# EAGLE schematic urbanNoiseMonitor (EAGLE 8.4.3)
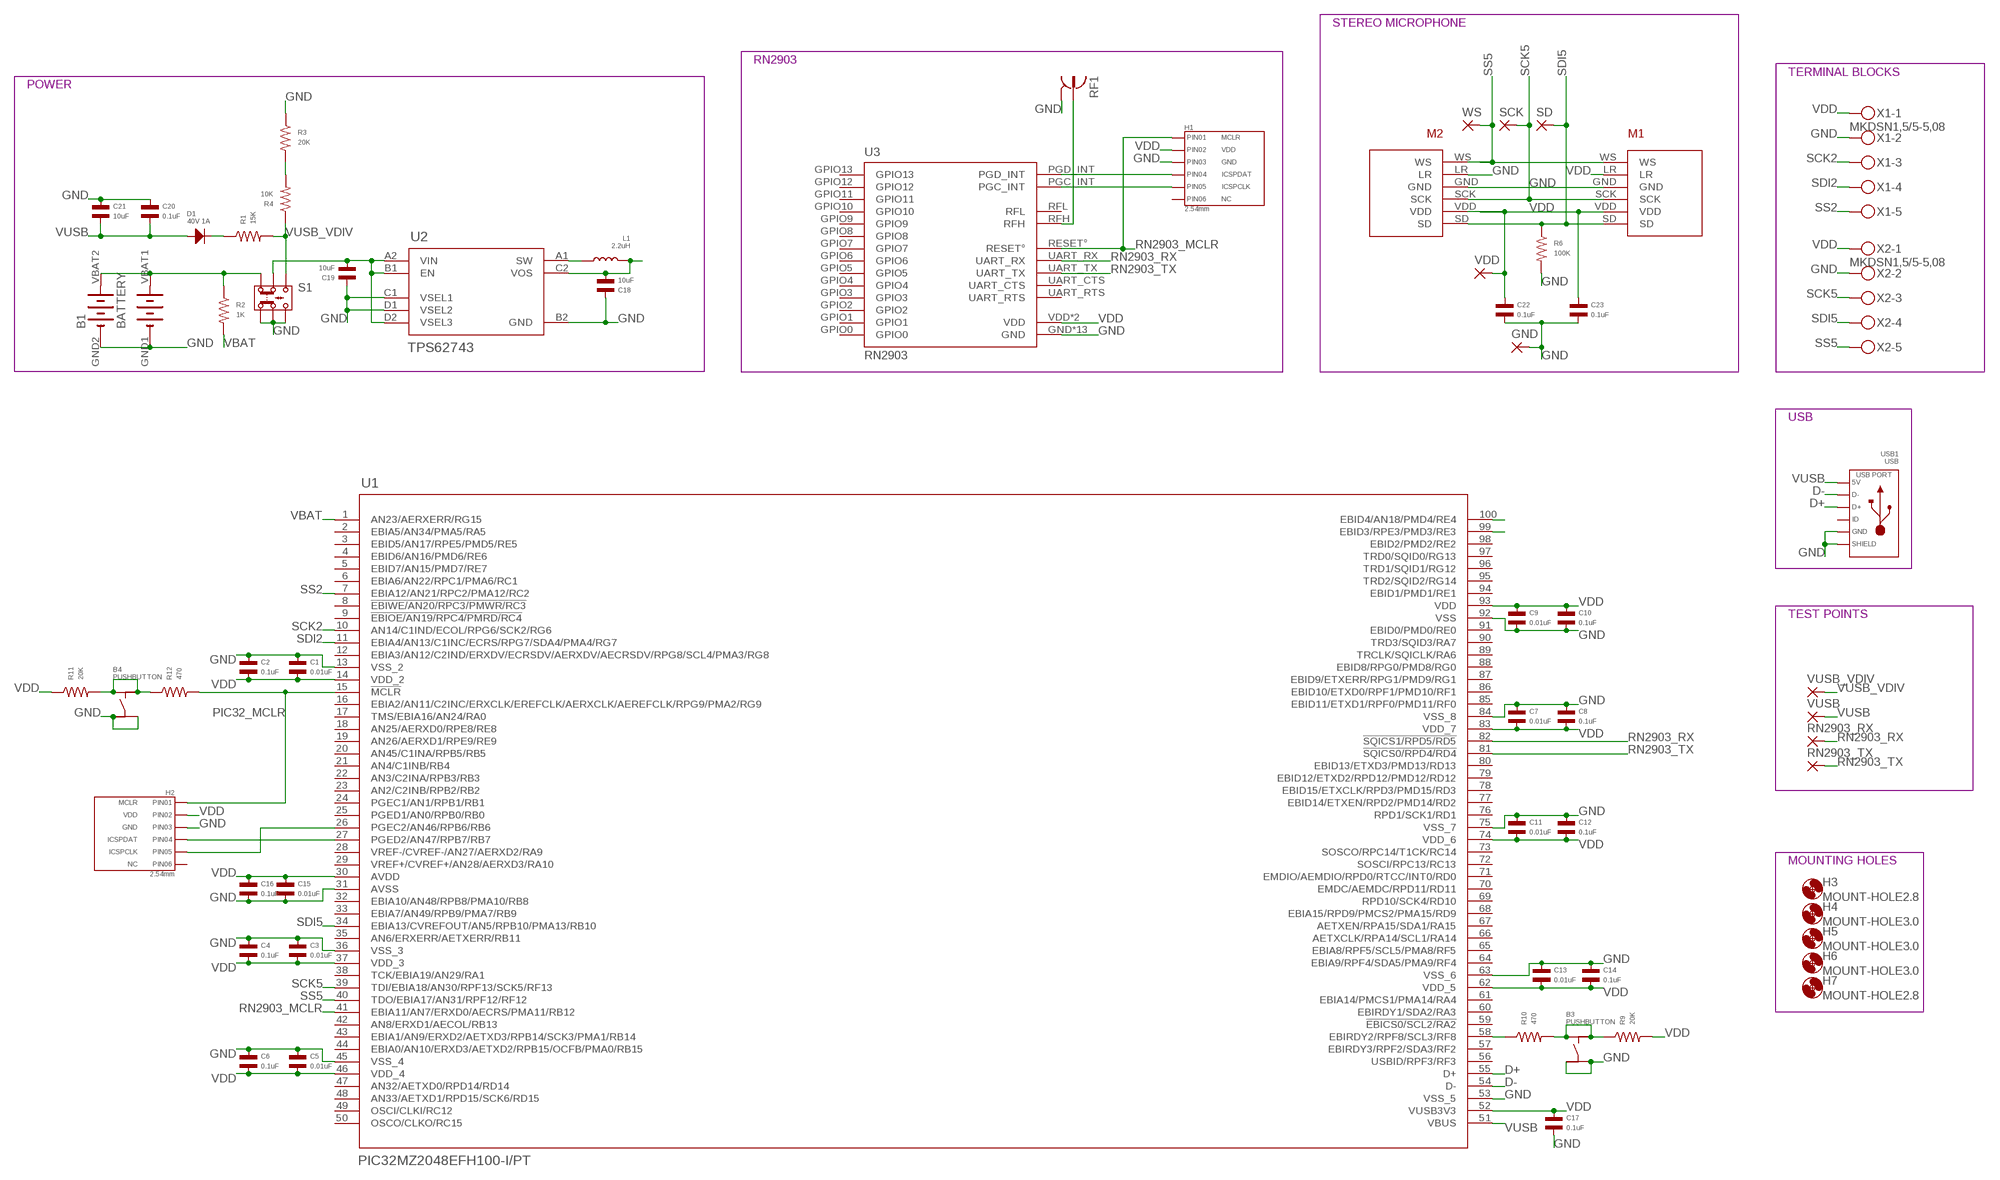
[diagram p0: schematic, sheet 1]

## Parts
B1  BATTERY  [36-2227-ND]
B3  PUSHBUTTON  [TACT6MM]
B4  PUSHBUTTON  [TACT6MM]
C1  0.01uF  CAPACITOR_NP  [C0402]
C2  0.1uF  CAPACITOR_NP  [C0402]
C3  0.01uF  CAPACITOR_NP  [C0402]
C4  0.1uF  CAPACITOR_NP  [C0402]
C5  0.01uF  CAPACITOR_NP  [C0402]
C6  0.1uF  CAPACITOR_NP  [C0402]
C7  0.01uF  CAPACITOR_NP  [C0402]
C8  0.1uF  CAPACITOR_NP  [C0402]
C9  0.01uF  CAPACITOR_NP  [C0402]
C10  0.1uF  CAPACITOR_NP  [C0402]
C11  0.01uF  CAPACITOR_NP  [C0402]
C12  0.1uF  CAPACITOR_NP  [C0402]
C13  0.01uF  CAPACITOR_NP  [C0402]
C14  0.1uF  CAPACITOR_NP  [C0402]
C15  0.01uF  CAPACITOR_NP  [C0402]
C16  0.1uF  CAPACITOR_NP  [C0402]
C17  0.1uF  CAPACITOR_NP  [C0402]
C18  10uF  CAPACITOR_NPC1206  [C1206]
C19  10uF  CAPACITOR_NPC1206  [C1206]
C20  0.1uF  CAPACITOR_NP  [C0402]
C21  10uF  CAPACITOR_NPC1206  [C1206]
C22  0.1uF  CAPACITOR_NP  [C0402]
C23  0.1uF  CAPACITOR_NP  [C0402]
D1  40V 1A  SCHOTTKY_DIODE  [SMA]
GND  2,54/1,0  [2,54/1,0]
H1  2.54mm  HEADER_PINS  [PTH_2.54MM_01X06]
H2  2.54mm  HEADER_PINS  [PTH_2.54MM_01X06]
H3  MOUNT-HOLE2.8  [2,8]
H4  MOUNT-HOLE3.0  [3,0]
H5  MOUNT-HOLE3.0  [3,0]
H6  MOUNT-HOLE3.0  [3,0]
H7  MOUNT-HOLE2.8  [2,8]
L1  2.2uH  DFE201610C  [L2016]
M1  MICROPHONE  [ICS-43434]
M2  MICROPHONE  [ICS-43434]
R1  15K  RESISTOR  [R0402]
R2  1K  RESISTOR  [R0402]
R3  20K  RESISTORR0805  [R0805]
R4  10K  RESISTOR  [R0402]
R6  100K  RESISTOR  [R0402]
R9  20K  RESISTORR0805  [R0805]
R10  470  RESISTOR  [R0402]
R11  20K  RESISTORR0805  [R0805]
R12  470  RESISTOR  [R0402]
RF1  SMA_JACK  [J502-ND-142-0711-821/826]
RN2903_RX  2,54/1,0  [2,54/1,0]
RN2903_TX  2,54/1,0  [2,54/1,0]
S1  SLIDING_SWITCH  [DPDT]
SCK  2,54/1,0  [2,54/1,0]
SD  2,54/1,0  [2,54/1,0]
U1  PIC32MZ2048EFH100-I/PT  [TQFP100_12X12MC]
U2  TPS62743  [YFP0008AGAC]
U3  RN2903  [RN2903]
USB1  USB  [MICROUSB-RIGHT]
VDD  2,54/1,0  [2,54/1,0]
VUSB  2,54/1,0  [2,54/1,0]
VUSB_VDIV  2,54/1,0  [2,54/1,0]
WS  2,54/1,0  [2,54/1,0]
X1  MKDSN1,5/5-5,08  [MKDSN1,5/5-5,08]
X2  MKDSN1,5/5-5,08  [MKDSN1,5/5-5,08]

## Nets
D+: U1.55(D+) USB1.3(D+)
D-: U1.54(D-) USB1.2(D-)
GND: B1.GND1 B1.GND2 B3.P$3 B3.P$4 B4.P$3 B4.P$4 C1.P$1 C2.P$1 C3.P$1 C4.P$1 C5.P$1 C6.P$1 C7.P$1 C8.P$1 C9.P$2 C10.P$2 C11.P$1 C12.P$1 C13.P$1 C14.P$1 C15.P$2 C16.P$2 C17.P$2 C18.P$1 C19.P$1 C20.P$1 C21.P$1 C22.P$2 C23.P$2 GND.1(P) H1.P$3(PIN3) H2.P$3(PIN3) M1.GND M2.GND M2.LR R3.P$1 R6.P$2 RF1.G@1 RF1.G@2 RF1.G@3 RF1.G@4 S1.1 S1.2 S1.3 U1.13(VSS_2) U1.31(AVSS) U1.36(VSS_3) U1.45(VSS_4) U1.53(VSS_5) U1.63(VSS_6) U1.75(VSS_7) U1.84(VSS_8) U1.92(VSS) U2.B2(GND) U2.C1(VSEL1) U2.D1(VSEL2) U3.GND U3.GND1(GND) U3.GND2(GND) U3.GND3(GND) U3.GND4(GND) U3.GND5(GND) U3.GND6(GND) U3.GND7(GND) U3.GND8(GND) U3.GND9(GND) U3.GND10(GND) U3.GND11(GND) U3.GND12(GND) USB1.5(GND) USB1.S1(SLD) USB1.S2(SLD) USB1.S3(SLD) USB1.S4(SLD) USB1.S5(SLD) USB1.S6(SLD) X1.2 X2.2
N$1: L1.P$2 U2.A1(SW)
N$2: C19.P$2 S1.5 U2.A2(VIN) U2.B1(EN) U2.D2(VSEL3)
N$3: B1.VBAT1 B1.VBAT2 R2.P$1 S1.4
N$4: D1.CATHODE R1.P$1
N$6: R3.P$2 R4.P$2
N$7: H1.P$4(PIN4) U3.PGD_INT
N$8: U1.100(EBID4/AN18/PMD4/RE4)
N$9: H1.P$5(PIN5) U3.PGC_INT
N$10: RF1.1 U3.RFH
N$11: U1.99(EBID3/RPE3/PMD3/RE3)
N$14: B3.P$1 B3.P$2 R9.P$1 R10.P$2
N$15: R10.P$1 U1.58(EBIRDY2/RPF8/SCL3/RF8)
N$17: H2.P$4(PIN4) U1.27(PGED2/AN47/RPB7/RB7)
N$18: H2.P$5(PIN5) U1.26(PGEC2/AN46/RPB6/RB6)
N$19: B4.P$1 B4.P$2 R11.P$2 R12.P$1
PIC32_MCLR: H2.P$1(PIN1) R12.P$2 U1.15(!MCLR)
RN2903_MCLR: H1.P$1(PIN1) U1.41(EBIA11/AN7/ERXD0/AECRS/PMA11/RB12) U3.RESET°
RN2903_RX: RN2903_RX.1(P) U1.82(!SQICS1/RPD5/RD5) U3.UART_RX
RN2903_TX: RN2903_TX.1(P) U1.81(!SQICS0/RPD4/RD4) U3.UART_TX
SCK2: U1.10(AN14/C1IND/ECOL/RPG6/SCK2/RG6) X1.3
SCK5: M1.SCK M2.SCK SCK.1(P) U1.39(TDI/EBIA18/AN30/RPF13/SCK5/RF13) X2.3
SDI2: U1.11(EBIA4/AN13/C1INC/ECRS/RPG7/SDA4/PMA4/RG7) X1.4
SDI5: M1.SD M2.SD R6.P$1 SD.1(P) U1.34(EBIA13/CVREFOUT/AN5/RPB10/PMA13/RB10) X2.4
SS2: U1.7(EBIA12/AN21/RPC2/PMA12/RC2) X1.5
SS5: M1.WS M2.WS U1.40(TDO/EBIA17/AN31/RPF12/RF12) WS.1(P) X2.5
VBAT: R2.P$2 U1.1(AN23/AERXERR/RG15)
VDD: C1.P$2 C2.P$2 C3.P$2 C4.P$2 C5.P$2 C6.P$2 C7.P$2 C8.P$2 C9.P$1 C10.P$1 C11.P$2 C12.P$2 C13.P$2 C14.P$2 C15.P$1 C16.P$1 C17.P$1 C18.P$2 C22.P$1 C23.P$1 H1.P$2(PIN2) H2.P$2(PIN2) L1.P$1 M1.LR M1.VDD M2.VDD R9.P$2 R11.P$1 U1.14(VDD_2) U1.30(AVDD) U1.37(VDD_3) U1.46(VDD_4) U1.52(VUSB3V3) U1.62(VDD_5) U1.74(VDD_6) U1.83(VDD_7) U1.93(VDD) U2.C2(VOS) U3.VDD U3.VDD2(VDD) VDD.1(P) X1.1 X2.1
VUSB: C20.P$2 C21.P$2 D1.ANODE U1.51(VBUS) USB1.1(5V) VUSB.1(P)
VUSB_VDIV: R1.P$2 R4.P$1 S1.6 VUSB_VDIV.1(P)
Unconnected: H1.P$6(PIN6) H2.P$6(PIN6) U1.2(EBIA5/AN34/PMA5/RA5) U1.3(EBID5/AN17/RPE5/PMD5/RE5) U1.4(EBID6/AN16/PMD6/RE6) U1.5(EBID7/AN15/PMD7/RE7) U1.6(EBIA6/AN22/RPC1/PMA6/RC1) U1.8(!EBIWE/AN20/RPC3/PMWR/RC3) U1.9(!EBIOE/AN19/RPC4/PMRD/RC4) U1.12(EBIA3/AN12/C2IND/ERXDV/ECRSDV/AERXDV/AECRSDV/RPG8/SCL4/PMA3/RG8) U1.16(EBIA2/AN11/C2INC/ERXCLK/EREFCLK/AERXCLK/AEREFCLK/RPG9/PMA2/RG9) U1.17(TMS/EBIA16/AN24/RA0) U1.18(AN25/AERXD0/RPE8/RE8) U1.19(AN26/AERXD1/RPE9/RE9) U1.20(AN45/C1INA/RPB5/RB5) U1.21(AN4/C1INB/RB4) U1.22(AN3/C2INA/RPB3/RB3) U1.23(AN2/C2INB/RPB2/RB2) U1.24(PGEC1/AN1/RPB1/RB1) U1.25(PGED1/AN0/RPB0/RB0) U1.28(VREF-/CVREF-/AN27/AERXD2/RA9) U1.29(VREF+/CVREF+/AN28/AERXD3/RA10) U1.32(EBIA10/AN48/RPB8/PMA10/RB8) U1.33(EBIA7/AN49/RPB9/PMA7/RB9) U1.35(AN6/ERXERR/AETXERR/RB11) U1.38(TCK/EBIA19/AN29/RA1) U1.42(AN8/ERXD1/AECOL/RB13) U1.43(EBIA1/AN9/ERXD2/AETXD3/RPB14/SCK3/PMA1/RB14) U1.44(EBIA0/AN10/ERXD3/AETXD2/RPB15/OCFB/PMA0/RB15) U1.47(AN32/AETXD0/RPD14/RD14) U1.48(AN33/AETXD1/RPD15/SCK6/RD15) U1.49(OSCI/CLKI/RC12) U1.50(OSCO/CLKO/RC15) U1.56(USBID/RPF3/RF3) U1.57(EBIRDY3/RPF2/SDA3/RF2) U1.59(!EBICS0/SCL2/RA2) U1.60(EBIRDY1/SDA2/RA3) U1.61(EBIA14/PMCS1/PMA14/RA4) U1.64(EBIA9/RPF4/SDA5/PMA9/RF4) U1.65(EBIA8/RPF5/SCL5/PMA8/RF5) U1.66(AETXCLK/RPA14/SCL1/RA14) U1.67(AETXEN/RPA15/SDA1/RA15) U1.68(EBIA15/RPD9/PMCS2/PMA15/RD9) U1.69(RPD10/SCK4/RD10) U1.70(EMDC/AEMDC/RPD11/RD11) U1.71(EMDIO/AEMDIO/RPD0/RTCC/INT0/RD0) U1.72(SOSCI/RPC13/RC13) U1.73(SOSCO/RPC14/T1CK/RC14) U1.76(RPD1/SCK1/RD1) U1.77(EBID14/ETXEN/RPD2/PMD14/RD2) U1.78(EBID15/ETXCLK/RPD3/PMD15/RD3) U1.79(EBID12/ETXD2/RPD12/PMD12/RD12) U1.80(EBID13/ETXD3/PMD13/RD13) U1.85(EBID11/ETXD1/RPF0/PMD11/RF0) U1.86(EBID10/ETXD0/RPF1/PMD10/RF1) U1.87(EBID9/ETXERR/RPG1/PMD9/RG1) U1.88(EBID8/RPG0/PMD8/RG0) U1.89(TRCLK/SQICLK/RA6) U1.90(TRD3/SQID3/RA7) U1.91(EBID0/PMD0/RE0) U1.94(EBID1/PMD1/RE1) U1.95(TRD2/SQID2/RG14) U1.96(TRD1/SQID1/RG12) U1.97(TRD0/SQID0/RG13) U1.98(EBID2/PMD2/RE2) U3.GPIO0 U3.GPIO1 U3.GPIO2 U3.GPIO3 U3.GPIO4 U3.GPIO5 U3.GPIO6 U3.GPIO7 U3.GPIO8 U3.GPIO9 U3.GPIO10 U3.GPIO11 U3.GPIO12 U3.GPIO13 U3.RFL U3.UART_CTS U3.UART_RTS USB1.4(ID)

## Notes on the sheet
- STEREO MICROPHONE
- RN2903
- TERMINAL BLOCKS
- POWER
- USB
- TEST POINTS
- MOUNTING HOLES

## Library data of the parts
B1 = myLibrary:BATTERY; MPN: 36-2227-ND; POPULATE: 0
B3 B4 = myLibrary:PUSHBUTTON; MPN: MF-SW-TACT-6MM; POPULATE: 1
C1 C3 C5 C7 C9 C11 C13 C15 = myLibrary:CAPACITOR_NP; MPN: MF-CAP-0402-0.01uF; POPULATE: 1
C2 C4 C6 C8 C10 C12 C14 C16 C17 C20 C22 C23 = myLibrary:CAPACITOR_NP; MPN: MF-CAP-0402-0.1uF; POPULATE: 1
C18 C19 C21 = myLibrary:CAPACITOR_NP; MPN: MF-CAP-1206-10uF; POPULATE: 1
D1 = myLibrary:SCHOTTKY_DIODE; MPN: MF-DIO-SMA-B140; POPULATE: 1
GND RN2903_RX RN2903_TX SCK SD VDD VUSB VUSB_VDIV WS = wirepad:2,54/1,0: THROUGH-HOLE PAD
H1 H2 = myLibrary:HEADER_PINS; LABEL01: MCLR; LABEL02: VDD; LABEL03: GND; LABEL04: ICSPDAT; LABEL05: ICSPCLK; LABEL06: NC; MPN: MF-CON-2.54mm-01x06; POPULATE: 0
H3-H7 = holes:MOUNT-HOLE: MOUNTING HOLE with drill center marker
L1 = myLibrary:DFE201610C; MPN: 1285AS-H-2R2M=P2; POPULATE: 1
M1 M2 = myLibrary:MICROPHONE; MPN: ICS-43434; POPULATE: 1
R1 = myLibrary:RESISTOR; MPN: MF-RES-0402-15K; POPULATE: 1
R2 = myLibrary:RESISTOR; MPN: MF-RES-0402-1K; POPULATE: 1
R3 R9 R11 = myLibrary:RESISTOR; MPN: MF-RES-0805-20K; POPULATE: 1
R4 = myLibrary:RESISTOR; MPN: MF-RES-0402-10K; POPULATE: 1
R6 = myLibrary:RESISTOR; MPN: MF-RES-0402-100K; POPULATE: 1
R10 R12 = myLibrary:RESISTOR; MPN: MF-RES-0402-470; POPULATE: 1
RF1 = myLibrary:SMA_JACK; MPN: SMA-J-P-H-ST-EM1; POPULATE: 1
S1 = myLibrary:SLIDING_SWITCH; MPN: JS202011SCQN; POPULATE: 1
U1 = myLibrary:PIC32MZ2048EFH100-I/PT; MPN: PIC32MZ2048EFH100-I/PT; POPULATE: 1
U2 = myLibrary:TPS62743; MPN: TPS62743YFPR; POPULATE: 1
U3 = myLibrary:RN2903; MPN: RN2903A-I/RM098; POPULATE: 1
USB1 = myLibrary:USB; MPN: MF-CON-MICROUSB-RIGHT; POPULATE: 1
X1 X2 = con-phoenix-508:MKDSN1,5/5-5,08: MKDSN 1,5/ 5-5,08 Printklemme Nennstrom: 13,5 A Nennspannung: 250 V Rastermaß: 5,08 mm Polzahl: 5 Anschlussart: Schraubanschluss Montage: Löten Anschlussrichtung Leiter/Platine: 0 ° Artikelnummer: 1729157 Source: http://eshop.phoenixcontact.com .. 1729157.pdf; MPN: 1729157; POPULATE: 0